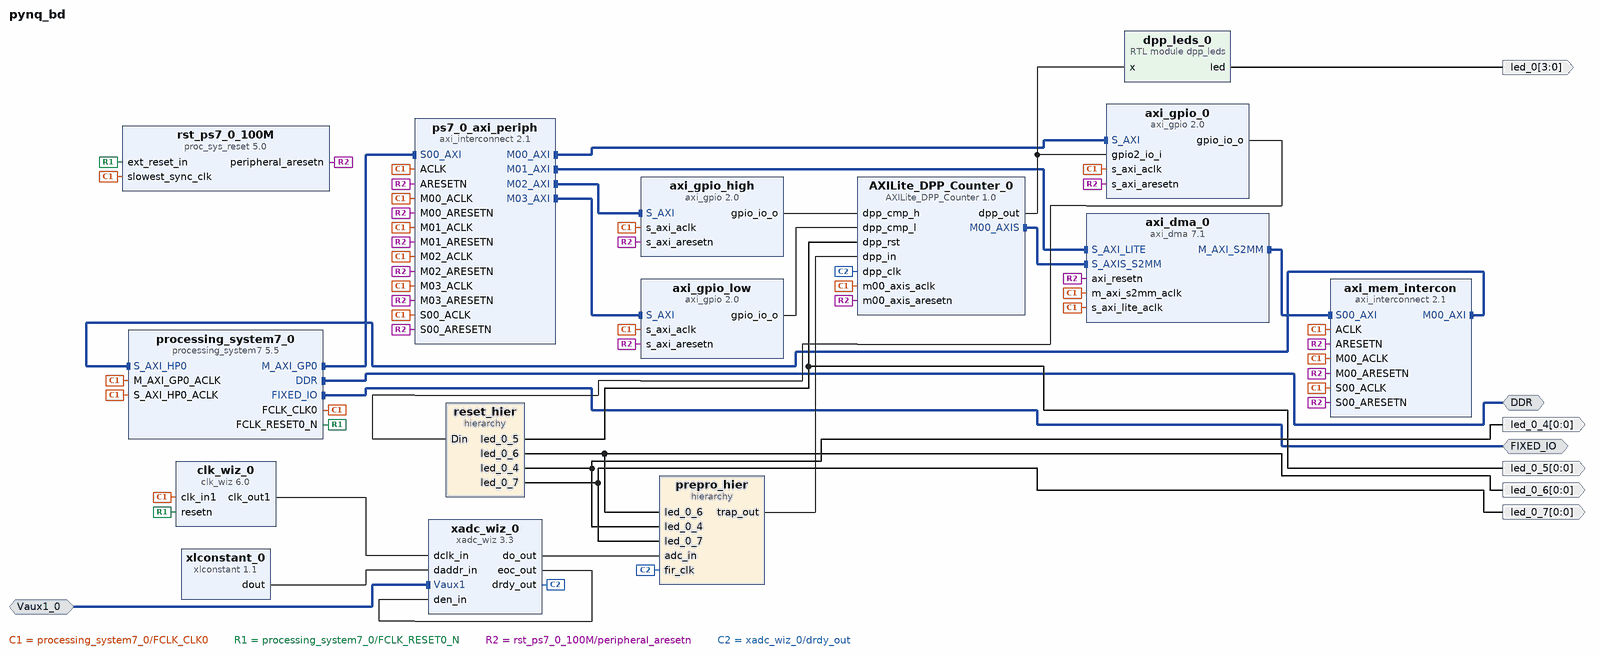
[diagram p0: block diagram of the top level]
# Vivado block design pynq_bd, xc7z020clg400-1, Vivado 2022.2
create_bd_design pynq_bd

create_bd_intf_port -mode Master -vlnv xilinx.com:interface:ddrx_rtl:1.0 DDR
create_bd_intf_port -mode Master -vlnv xilinx.com:display_processing_system7:fixedio_rtl:1.0 FIXED_IO
create_bd_intf_port -mode Slave -vlnv xilinx.com:interface:diff_analog_io_rtl:1.0 Vaux1_0
create_bd_port -dir O -from 0 -to 0 led_0_4
create_bd_port -dir O -from 3 -to 0 led_0
create_bd_port -dir O -from 0 -to 0 led_0_5
create_bd_port -dir O -from 0 -to 0 led_0_6
create_bd_port -dir O -from 0 -to 0 led_0_7

create_bd_cell -type ip -vlnv xilinx.com:ip:processing_system7:5.5 processing_system7_0
set_property -dict [list \
  CONFIG.PCW_APU_PERIPHERAL_FREQMHZ 650 \
  CONFIG.PCW_CRYSTAL_PERIPHERAL_FREQMHZ 50 \
  CONFIG.PCW_ENET0_ENET0_IO {MIO 16 .. 27} \
  CONFIG.PCW_ENET0_GRP_MDIO_ENABLE 1 \
  CONFIG.PCW_ENET0_GRP_MDIO_IO {MIO 52 .. 53} \
  CONFIG.PCW_ENET0_PERIPHERAL_ENABLE 1 \
  CONFIG.PCW_ENET0_RESET_ENABLE 1 \
  CONFIG.PCW_ENET0_RESET_IO {MIO 9} \
  CONFIG.PCW_ENET_RESET_ENABLE 1 \
  CONFIG.PCW_ENET_RESET_SELECT {Share reset pin} \
  CONFIG.PCW_FPGA0_PERIPHERAL_FREQMHZ 100 \
  CONFIG.PCW_FPGA1_PERIPHERAL_FREQMHZ 50 \
  CONFIG.PCW_GPIO_MIO_GPIO_ENABLE 1 \
  CONFIG.PCW_GPIO_MIO_GPIO_IO MIO \
  CONFIG.PCW_I2C_RESET_ENABLE 1 \
  CONFIG.PCW_M_AXI_GP0_FREQMHZ 10 \
  CONFIG.PCW_PERIPHERAL_BOARD_PRESET None \
  CONFIG.PCW_PRESET_BANK1_VOLTAGE {LVCMOS 1.8V} \
  CONFIG.PCW_QSPI_GRP_FBCLK_ENABLE 1 \
  CONFIG.PCW_QSPI_GRP_FBCLK_IO {MIO 8} \
  CONFIG.PCW_QSPI_GRP_SINGLE_SS_ENABLE 1 \
  CONFIG.PCW_QSPI_GRP_SINGLE_SS_IO {MIO 1 .. 6} \
  CONFIG.PCW_QSPI_PERIPHERAL_ENABLE 1 \
  CONFIG.PCW_QSPI_QSPI_IO {MIO 1 .. 6} \
  CONFIG.PCW_SD0_GRP_CD_ENABLE 1 \
  CONFIG.PCW_SD0_GRP_CD_IO {MIO 47} \
  CONFIG.PCW_SD0_GRP_WP_ENABLE 0 \
  CONFIG.PCW_SD0_PERIPHERAL_ENABLE 1 \
  CONFIG.PCW_SD0_SD0_IO {MIO 40 .. 45} \
  CONFIG.PCW_SDIO_PERIPHERAL_FREQMHZ 50 \
  CONFIG.PCW_SINGLE_QSPI_DATA_MODE x4 \
  CONFIG.PCW_S_AXI_HP0_FREQMHZ 10 \
  CONFIG.PCW_UART0_PERIPHERAL_ENABLE 1 \
  CONFIG.PCW_UART0_UART0_IO {MIO 14 .. 15} \
  CONFIG.PCW_UART1_PERIPHERAL_ENABLE 0 \
  CONFIG.PCW_UART_PERIPHERAL_FREQMHZ 100 \
  CONFIG.PCW_UIPARAM_DDR_BUS_WIDTH {16 Bit} \
  CONFIG.PCW_UIPARAM_DDR_FREQ_MHZ 525 \
  CONFIG.PCW_UIPARAM_DDR_PARTNO {MT41J256M16 RE-125} \
  CONFIG.PCW_USB0_PERIPHERAL_ENABLE 1 \
  CONFIG.PCW_USB0_RESET_ENABLE 1 \
  CONFIG.PCW_USB0_RESET_IO {MIO 46} \
  CONFIG.PCW_USB0_USB0_IO {MIO 28 .. 39} \
  CONFIG.PCW_USB_RESET_ENABLE 1 \
  CONFIG.PCW_USB_RESET_SELECT {Share reset pin} \
  CONFIG.PCW_USE_S_AXI_HP0 1 \
] [get_bd_cells processing_system7_0]
# 482 more settings of processing_system7_0 are not shown: defaults, MIO pin electricals, DDR timing, and values the tool derives
create_bd_cell -type ip -vlnv xilinx.com:ip:xadc_wiz:3.3 xadc_wiz_0
set_property -dict [list \
  CONFIG.ADC_CONVERSION_RATE 1000 \
  CONFIG.ADC_OFFSET_AND_GAIN_CALIBRATION false \
  CONFIG.DCLK_FREQUENCY 104 \
  CONFIG.ENABLE_CALIBRATION_AVERAGING false \
  CONFIG.ENABLE_RESET true \
  CONFIG.ENABLE_VCCDDRO_ALARM false \
  CONFIG.ENABLE_VCCPAUX_ALARM false \
  CONFIG.ENABLE_VCCPINT_ALARM false \
  CONFIG.INTERFACE_SELECTION ENABLE_DRP \
  CONFIG.OT_ALARM false \
  CONFIG.SENSOR_OFFSET_AND_GAIN_CALIBRATION false \
  CONFIG.SINGLE_CHANNEL_SELECTION VAUXP1_VAUXN1 \
  CONFIG.USER_TEMP_ALARM false \
  CONFIG.VCCAUX_ALARM false \
  CONFIG.VCCINT_ALARM false \
] [get_bd_cells xadc_wiz_0]
create_bd_cell -type ip -vlnv xilinx.com:ip:clk_wiz:6.0 clk_wiz_0
set_property -dict [list \
  CONFIG.CLKOUT1_JITTER 129.027 \
  CONFIG.CLKOUT1_PHASE_ERROR 99.281 \
  CONFIG.CLKOUT1_REQUESTED_OUT_FREQ 104 \
  CONFIG.MMCM_CLKFBOUT_MULT_F 9.750 \
  CONFIG.MMCM_CLKOUT0_DIVIDE_F 9.375 \
  CONFIG.RESET_PORT resetn \
  CONFIG.RESET_TYPE ACTIVE_LOW \
] [get_bd_cells clk_wiz_0]
create_bd_cell -type ip -vlnv xilinx.com:ip:xlconstant:1.1 xlconstant_0
set_property -dict {CONFIG.CONST_VAL 17 CONFIG.CONST_WIDTH 7} [get_bd_cells xlconstant_0]
create_bd_cell -type ip -vlnv xilinx.com:ip:axi_gpio:2.0 axi_gpio_0
set_property -dict {CONFIG.C_IS_DUAL 1} [get_bd_cells axi_gpio_0]
create_bd_cell -type ip -vlnv xilinx.com:ip:axi_interconnect:2.1 ps7_0_axi_periph
set_property -dict {CONFIG.NUM_MI 4} [get_bd_cells ps7_0_axi_periph]
create_bd_cell -type ip -vlnv xilinx.com:ip:proc_sys_reset:5.0 rst_ps7_0_100M
create_bd_cell -type ip -vlnv xilinx.com:ip:axi_dma:7.1 axi_dma_0
set_property -dict [list \
  CONFIG.c_include_mm2s 0 \
  CONFIG.c_include_sg 0 \
  CONFIG.c_s2mm_burst_size 256 \
  CONFIG.c_sg_length_width 12 \
] [get_bd_cells axi_dma_0]
create_bd_cell -type ip -vlnv xilinx.com:ip:axi_interconnect:2.1 axi_mem_intercon
set_property -dict {CONFIG.NUM_MI 1} [get_bd_cells axi_mem_intercon]
create_bd_cell -type module -reference dpp_leds dpp_leds_0
create_bd_cell -type hier prepro_hier
create_bd_cell -type hier reset_hier
create_bd_cell -type ip -vlnv xilinx.com:ip:axi_gpio:2.0 axi_gpio_low
set_property -dict {CONFIG.C_DOUT_DEFAULT 0x0000C350} [get_bd_cells axi_gpio_low]
create_bd_cell -type ip -vlnv xilinx.com:ip:axi_gpio:2.0 axi_gpio_high
set_property -dict {CONFIG.C_DOUT_DEFAULT 0x01312D00} [get_bd_cells axi_gpio_high]
create_bd_cell -type ip -vlnv xilinx.com:user:AXILite_DPP_Counter:1.0 AXILite_DPP_Counter_0

# ---- hierarchy /prepro_hier ----
current_bd_instance /prepro_hier
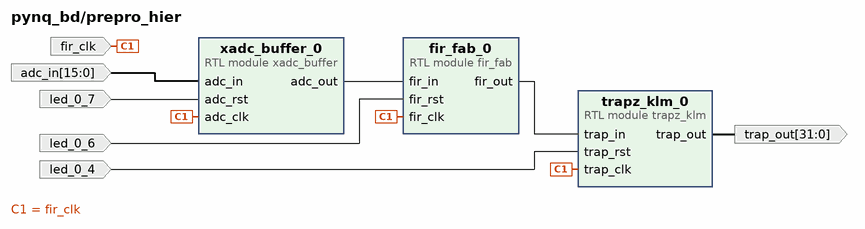
[diagram p1: block diagram inside /prepro_hier]
create_bd_pin -dir I -type clk fir_clk
create_bd_pin -dir I -type rst led_0_7
create_bd_pin -dir I -from 15 -to 0 adc_in
create_bd_pin -dir I -type rst led_0_6
create_bd_pin -dir I -type rst led_0_4
create_bd_pin -dir O -from 31 -to 0 trap_out

create_bd_cell -type module -reference xadc_buffer xadc_buffer_0
create_bd_cell -type module -reference fir_fab fir_fab_0
create_bd_cell -type module -reference trapz_klm trapz_klm_0

# ---- hierarchy /reset_hier ----
current_bd_instance /reset_hier
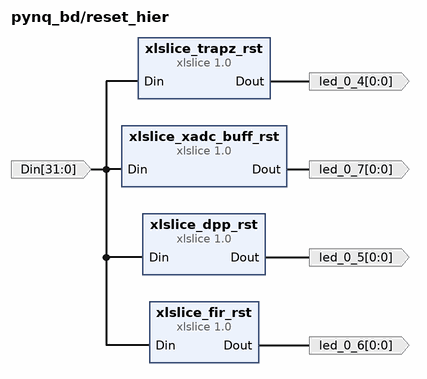
[diagram p2: block diagram inside /reset_hier]
create_bd_pin -dir I -from 31 -to 0 Din
create_bd_pin -dir O -from 0 -to 0 led_0_6
create_bd_pin -dir O -from 0 -to 0 led_0_7
create_bd_pin -dir O -from 0 -to 0 led_0_4
create_bd_pin -dir O -from 0 -to 0 led_0_5

create_bd_cell -type ip -vlnv xilinx.com:ip:xlslice:1.0 xlslice_fir_rst
set_property -dict {CONFIG.DIN_FROM 1 CONFIG.DIN_TO 1} [get_bd_cells xlslice_fir_rst]
create_bd_cell -type ip -vlnv xilinx.com:ip:xlslice:1.0 xlslice_xadc_buff_rst
set_property -dict {CONFIG.DIN_FROM 0 CONFIG.DIN_TO 0} [get_bd_cells xlslice_xadc_buff_rst]
create_bd_cell -type ip -vlnv xilinx.com:ip:xlslice:1.0 xlslice_trapz_rst
set_property -dict {CONFIG.DIN_FROM 2 CONFIG.DIN_TO 2} [get_bd_cells xlslice_trapz_rst]
create_bd_cell -type ip -vlnv xilinx.com:ip:xlslice:1.0 xlslice_dpp_rst
set_property -dict {CONFIG.DIN_FROM 3 CONFIG.DIN_TO 3} [get_bd_cells xlslice_dpp_rst]

# ---- connections ----

current_bd_instance /prepro_hier
connect_bd_net -net Prepro_hierarchy_trap_out [get_bd_pins trapz_klm_0/trap_out] [get_bd_pins trap_out]
connect_bd_net [get_bd_pins fir_fab_0/fir_out] [get_bd_pins trapz_klm_0/trap_in]
connect_bd_net [get_bd_pins xadc_buffer_0/adc_out] [get_bd_pins fir_fab_0/fir_in]
connect_bd_net -net xadc_wiz_0_do_out [get_bd_pins adc_in] [get_bd_pins xadc_buffer_0/adc_in]
connect_bd_net -net xadc_wiz_0_drdy_out [get_bd_pins fir_clk] \
  [get_bd_pins fir_fab_0/fir_clk] [get_bd_pins trapz_klm_0/trap_clk] [get_bd_pins xadc_buffer_0/adc_clk]
connect_bd_net -net xlslice_fir_rst_Dout [get_bd_pins led_0_6] [get_bd_pins fir_fab_0/fir_rst]
connect_bd_net -net xlslice_trapz_rst_Dout [get_bd_pins led_0_4] [get_bd_pins trapz_klm_0/trap_rst]
connect_bd_net -net xlslice_xadc_buff_rst_Dout [get_bd_pins led_0_7] [get_bd_pins xadc_buffer_0/adc_rst]

current_bd_instance /reset_hier
connect_bd_net -net axi_gpio_0_gpio_io_o [get_bd_pins Din] \
  [get_bd_pins xlslice_xadc_buff_rst/Din] [get_bd_pins xlslice_trapz_rst/Din] [get_bd_pins xlslice_dpp_rst/Din] \
  [get_bd_pins xlslice_fir_rst/Din]
connect_bd_net [get_bd_pins xlslice_dpp_rst/Dout] [get_bd_pins led_0_5]
connect_bd_net [get_bd_pins xlslice_fir_rst/Dout] [get_bd_pins led_0_6]
connect_bd_net [get_bd_pins xlslice_trapz_rst/Dout] [get_bd_pins led_0_4]
connect_bd_net [get_bd_pins xlslice_xadc_buff_rst/Dout] [get_bd_pins led_0_7]

current_bd_instance /
connect_bd_intf_net [get_bd_intf_pins axi_dma_0/S_AXIS_S2MM] [get_bd_intf_pins AXILite_DPP_Counter_0/M00_AXIS]
connect_bd_intf_net -intf_net Vaux1_0_1 [get_bd_intf_ports Vaux1_0] [get_bd_intf_pins xadc_wiz_0/Vaux1]
connect_bd_intf_net [get_bd_intf_pins axi_dma_0/M_AXI_S2MM] [get_bd_intf_pins axi_mem_intercon/S00_AXI]
connect_bd_intf_net [get_bd_intf_pins axi_mem_intercon/M00_AXI] [get_bd_intf_pins processing_system7_0/S_AXI_HP0]
connect_bd_intf_net [get_bd_intf_ports DDR] [get_bd_intf_pins processing_system7_0/DDR]
connect_bd_intf_net [get_bd_intf_ports FIXED_IO] [get_bd_intf_pins processing_system7_0/FIXED_IO]
connect_bd_intf_net [get_bd_intf_pins processing_system7_0/M_AXI_GP0] [get_bd_intf_pins ps7_0_axi_periph/S00_AXI]
connect_bd_intf_net [get_bd_intf_pins ps7_0_axi_periph/M00_AXI] [get_bd_intf_pins axi_gpio_0/S_AXI]
connect_bd_intf_net [get_bd_intf_pins ps7_0_axi_periph/M01_AXI] [get_bd_intf_pins axi_dma_0/S_AXI_LITE]
connect_bd_intf_net [get_bd_intf_pins ps7_0_axi_periph/M02_AXI] [get_bd_intf_pins axi_gpio_high/S_AXI]
connect_bd_intf_net [get_bd_intf_pins ps7_0_axi_periph/M03_AXI] [get_bd_intf_pins axi_gpio_low/S_AXI]
connect_bd_net -net AXILite_DPP_Counter_0_dpplite_cmp_h [get_bd_pins axi_gpio_high/gpio_io_o] [get_bd_pins AXILite_DPP_Counter_0/dpp_cmp_h]
connect_bd_net -net AXILite_DPP_Counter_0_dpplite_cmp_l [get_bd_pins axi_gpio_low/gpio_io_o] [get_bd_pins AXILite_DPP_Counter_0/dpp_cmp_l]
connect_bd_net -net AXI_DPP_Counter_0_dpp_out [get_bd_pins AXILite_DPP_Counter_0/dpp_out] \
  [get_bd_pins axi_gpio_0/gpio2_io_i] [get_bd_pins dpp_leds_0/x]
connect_bd_net -net Prepro_hierarchy_trap_out [get_bd_pins prepro_hier/trap_out] [get_bd_pins AXILite_DPP_Counter_0/dpp_in]
connect_bd_net [get_bd_pins axi_gpio_0/gpio_io_o] [get_bd_pins reset_hier/Din]
connect_bd_net [get_bd_pins clk_wiz_0/clk_out1] [get_bd_pins xadc_wiz_0/dclk_in]
connect_bd_net [get_bd_pins dpp_leds_0/led] [get_bd_ports led_0]
connect_bd_net [get_bd_pins processing_system7_0/FCLK_CLK0] \
  [get_bd_pins clk_wiz_0/clk_in1] [get_bd_pins processing_system7_0/M_AXI_GP0_ACLK] [get_bd_pins ps7_0_axi_periph/S00_ACLK] \
  [get_bd_pins rst_ps7_0_100M/slowest_sync_clk] [get_bd_pins axi_gpio_0/s_axi_aclk] [get_bd_pins ps7_0_axi_periph/M00_ACLK] \
  [get_bd_pins ps7_0_axi_periph/ACLK] [get_bd_pins axi_dma_0/s_axi_lite_aclk] [get_bd_pins ps7_0_axi_periph/M01_ACLK] \
  [get_bd_pins axi_dma_0/m_axi_s2mm_aclk] [get_bd_pins axi_mem_intercon/S00_ACLK] \
  [get_bd_pins processing_system7_0/S_AXI_HP0_ACLK] [get_bd_pins axi_mem_intercon/M00_ACLK] \
  [get_bd_pins axi_mem_intercon/ACLK] [get_bd_pins ps7_0_axi_periph/M02_ACLK] [get_bd_pins axi_gpio_high/s_axi_aclk] \
  [get_bd_pins axi_gpio_low/s_axi_aclk] [get_bd_pins ps7_0_axi_periph/M03_ACLK] \
  [get_bd_pins AXILite_DPP_Counter_0/m00_axis_aclk]
connect_bd_net [get_bd_pins processing_system7_0/FCLK_RESET0_N] [get_bd_pins clk_wiz_0/resetn] [get_bd_pins rst_ps7_0_100M/ext_reset_in]
connect_bd_net [get_bd_pins rst_ps7_0_100M/peripheral_aresetn] \
  [get_bd_pins ps7_0_axi_periph/S00_ARESETN] [get_bd_pins axi_gpio_0/s_axi_aresetn] \
  [get_bd_pins ps7_0_axi_periph/M00_ARESETN] [get_bd_pins ps7_0_axi_periph/ARESETN] [get_bd_pins axi_dma_0/axi_resetn] \
  [get_bd_pins ps7_0_axi_periph/M01_ARESETN] [get_bd_pins axi_mem_intercon/S00_ARESETN] \
  [get_bd_pins axi_mem_intercon/M00_ARESETN] [get_bd_pins axi_mem_intercon/ARESETN] \
  [get_bd_pins ps7_0_axi_periph/M02_ARESETN] [get_bd_pins axi_gpio_high/s_axi_aresetn] \
  [get_bd_pins axi_gpio_low/s_axi_aresetn] [get_bd_pins ps7_0_axi_periph/M03_ARESETN] \
  [get_bd_pins AXILite_DPP_Counter_0/m00_axis_aresetn]
connect_bd_net [get_bd_pins xadc_wiz_0/do_out] [get_bd_pins prepro_hier/adc_in]
connect_bd_net [get_bd_pins xadc_wiz_0/drdy_out] [get_bd_pins prepro_hier/fir_clk] [get_bd_pins AXILite_DPP_Counter_0/dpp_clk]
connect_bd_net [get_bd_pins xadc_wiz_0/eoc_out] [get_bd_pins xadc_wiz_0/den_in]
connect_bd_net [get_bd_pins xlconstant_0/dout] [get_bd_pins xadc_wiz_0/daddr_in]
connect_bd_net -net xlslice_dpp_rst_Dout [get_bd_pins reset_hier/led_0_5] [get_bd_ports led_0_5] [get_bd_pins AXILite_DPP_Counter_0/dpp_rst]
connect_bd_net -net xlslice_fir_rst_Dout [get_bd_pins reset_hier/led_0_6] [get_bd_ports led_0_6] [get_bd_pins prepro_hier/led_0_6]
connect_bd_net -net xlslice_trapz_rst_Dout [get_bd_pins reset_hier/led_0_4] [get_bd_ports led_0_4] [get_bd_pins prepro_hier/led_0_4]
connect_bd_net -net xlslice_xadc_buff_rst_Dout [get_bd_pins reset_hier/led_0_7] [get_bd_ports led_0_7] [get_bd_pins prepro_hier/led_0_7]

# ---- address map ----
assign_bd_address -offset 0x00000000 -range 512M -target_address_space [get_bd_addr_spaces axi_dma_0/Data_S2MM] [get_bd_addr_segs processing_system7_0/S_AXI_HP0/HP0_DDR_LOWOCM]
assign_bd_address -offset 0x40400000 -range 64K -target_address_space [get_bd_addr_spaces processing_system7_0/Data] [get_bd_addr_segs axi_dma_0/S_AXI_LITE/Reg]
assign_bd_address -offset 0x41200000 -range 64K -target_address_space [get_bd_addr_spaces processing_system7_0/Data] [get_bd_addr_segs axi_gpio_0/S_AXI/Reg]
assign_bd_address -offset 0x41210000 -range 64K -target_address_space [get_bd_addr_spaces processing_system7_0/Data] [get_bd_addr_segs axi_gpio_high/S_AXI/Reg]
assign_bd_address -offset 0x41220000 -range 64K -target_address_space [get_bd_addr_spaces processing_system7_0/Data] [get_bd_addr_segs axi_gpio_low/S_AXI/Reg]

validate_bd_design
save_bd_design
